# EAGLE design mains (EAGLE 7.1.0)
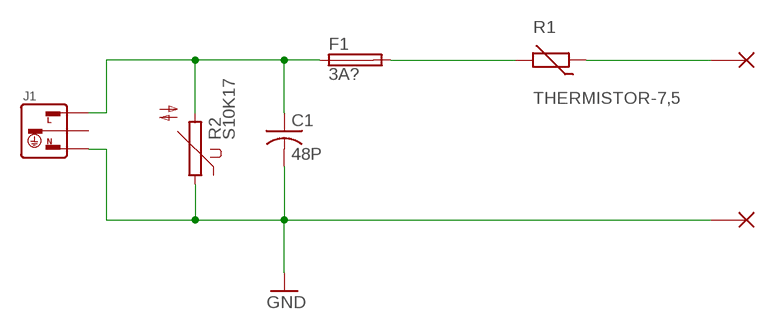
[diagram p0: schematic, sheet 1]

## Parts
C1  48P  C-075PTH  [C075]
F1  3A?  FUSEBLANK_5X20MM  [FUSE_HOLDER_5X20MM]
J1  AC-JACK-3-ADAMTEC-IEC-A-4  [ADAMTEC-IEC-A-4]
R1  THERMISTOR-7,5  [R-7,5]
R2  S10K17  [S10K17]
X3  WIREPAD_14GA  [PAD_14GA]
X4  WIREPAD_14GA  [PAD_14GA]

## Nets
GND: C1.2(-) J1.N R2.1 X4.P$1(P)
N$1: C1.1(+) F1.1 J1.L R2.2
N$2: F1.2 R1.2
N$4: R1.1 X3.P$1(P)
Unconnected: J1.G

## Library data of the parts
C1 = bt_rcl:C: Capacitor, non-polarized, American symbol
F1 = fuse:FUSE: Fuse; OC_FARNELL: unknown; OC_NEWARK: unknown
J1 = bt_electromech:AC-JACK-3: 3-Prong AC Jack
R1 = varistor:THERMISTOR: THERMISTOR
R2 = varistor:S10K17: VARISTOR
X3 X4 = bt_electromech:WIREPAD: PIN PAD Generic pin pad / wire pad / wirepad connector

## Board
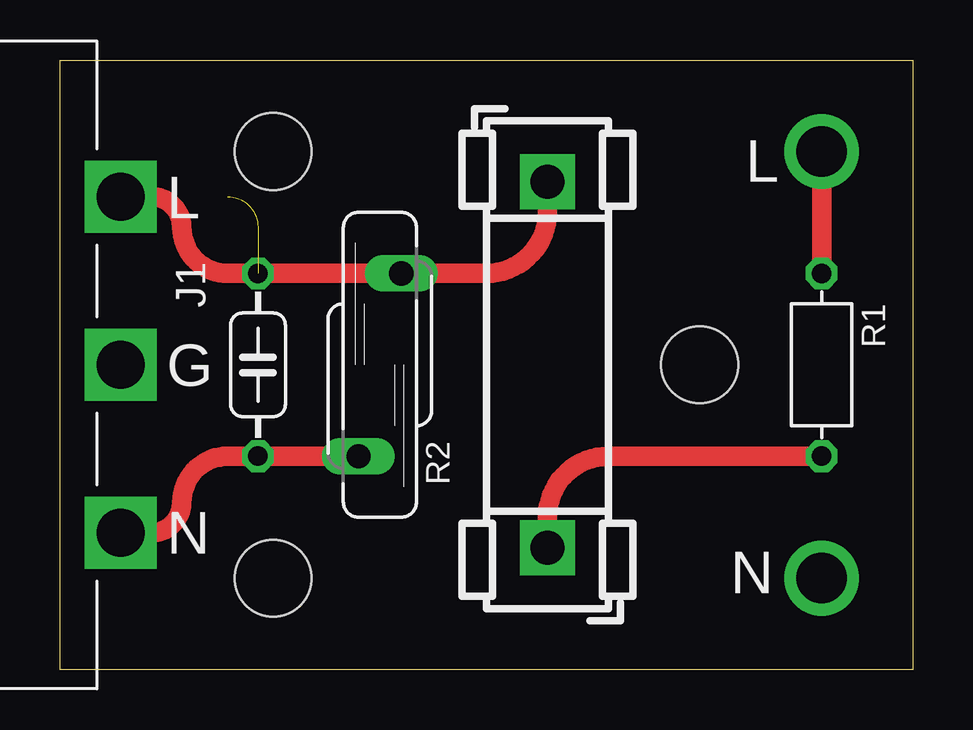
[diagram p1: board, top side]
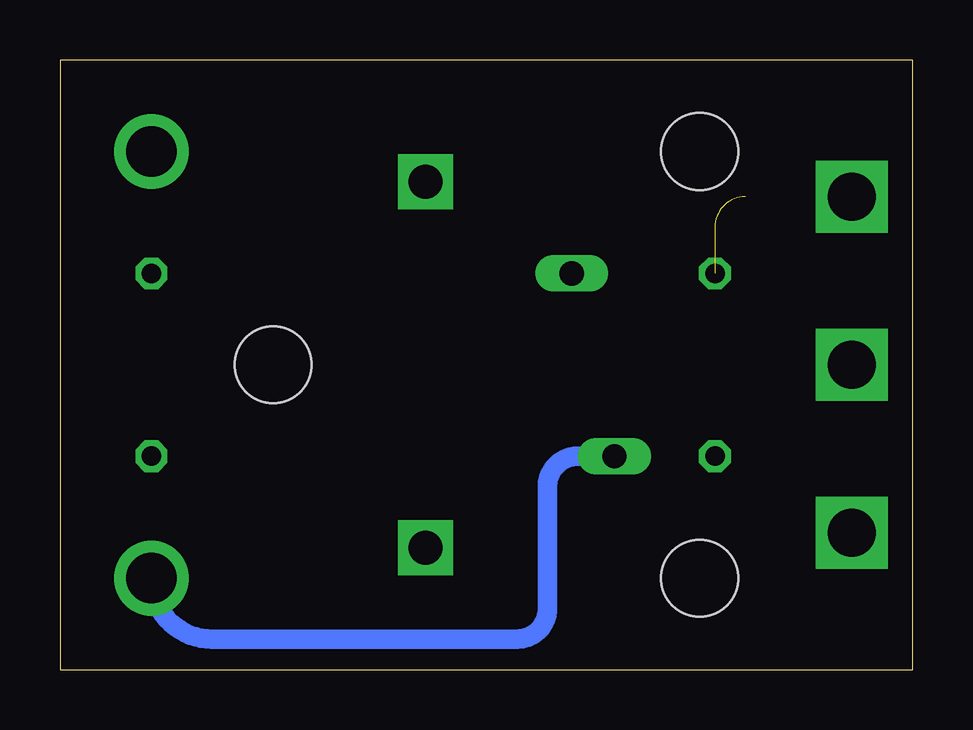
[diagram p2: board, bottom side, seen from below]

Size 35.56 x 25.4 mm. Coordinates in mm from the lower left corner, seen from the top.
Outline: 0,25.4 35.56,25.4 35.56,0 0,0 0,25.4
Copper layers (1*16): Top 0.035mm / dielectric 1.5mm / Bottom 0.035mm
Design rules "default": minimum track width 10mil, minimum drill 0.6mm, track to track 8mil, track to pad 8mil, pad to pad 8mil, via to via 8mil, smd to smd 8mil, copper to edge 40mil, drill to drill 8mil, minimum pad ring 10mil, minimum via ring 8mil, stop-mask expansion 4mil, vias tented up to drill 0mil, thermal gap 10mil
Holes 3.2 mm at 8.89,21.59 8.89,3.81 26.67,12.7

### Footprints (pad centres in the part's own frame; a part is rotated, then mirrored left to right if it is on the bottom)
C075 = drill 0.813 octagon: 1 -3.81,0; 2 3.81,0
FUSE_HOLDER_5X20MM = drill 1.422 pad 2.286 square: 1 0,0; 2 15.24,0
ADAMTEC-IEC-A-4 = drill 2 square: G 0,0; L 7,0; N -7,0
R-7,5 = drill 0.813 octagon: 1 -3.81,0; 2 3.81,0
S10K17 = drill 1.016 long: 1 -0.889,-3.81; 2 0.889,3.81
PAD_14GA = drill 2.1: P$1 0,0

### Placement (x,y rotation side)
C1  8.26,12.7 270 top
F1  20.32,20.32 270 top
J1  2.54,12.7 90 top
R1  31.75,12.7 270 top
R2  13.34,12.7 0 top
X3  31.75,21.59 0 top
X4  31.75,3.81 0 top

### Tracks (layer width: path | path; a pad name or v marks a point on that pad's centre or on a via)
GND
  Top 0.813: R2.1 C1.2 7,8.89 arc90 5.08,6.97 arc-90 3.81,5.7 J1.N
  Bottom 0.813: R2.1 13.97,8.89 arc-90 15.24,7.62 15.24,2.54 arc90 16.51,1.27 29.21,1.27 arc90 X4.P$1
N$1  (2 unrouted)
  Top 0.813: F1.1 20.32,19.05 arc-90 17.78,16.51 R2.2 C1.1 7,16.51 arc-90 5.08,18.43 arc90 3.81,19.7 J1.L
N$2
  Top 0.813: F1.2 20.32,6.35 arc-90 22.86,8.89 R1.2
N$4
  Top 0.813: R1.1 X3.P$1

### Text on the board
tNames: L | L | G | N | N